# Altium project TactSwitch_Module_v2.PrjPcb
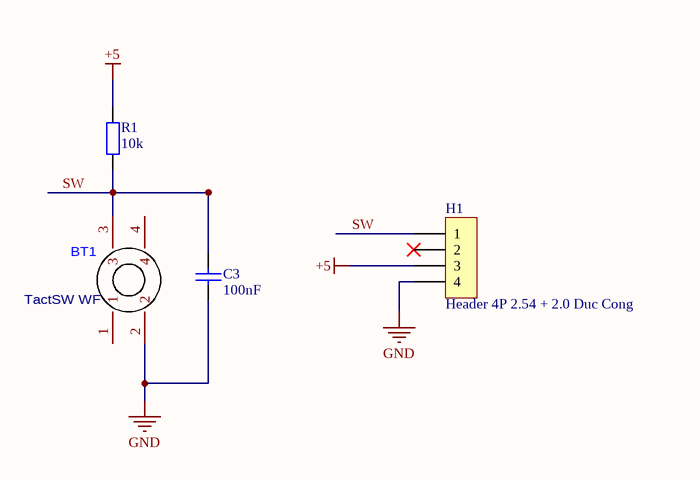
[diagram p0: TactSwitch_v2_SCH.SchDoc]
1 sheet, 4 parts. Net scope: global (net labels, ports and power ports of the same name join across sheets).
Board file: TactSwitch_v2_PCB.PcbDoc

## Sheet TactSwitch_v2_SCH.SchDoc
size A4; SheetNumber: 1; SheetTotal: 1

### Parts
BT1  TactSW WF  [12X12 BUTTOM red]
C3  100nF  [tu 0603]
H1  Header 4P 2.54 + 2.0 Duc Cong  [Header 4P DC 2.54 + 2.0]
R1  10k  [tro smd 0603]

### Nets
+5: H1.3 R1.2
GND: BT1.2 C3.2 H1.4
SW: BT1.3 C3.1 H1.1 R1.1

Not connected (* = marked no-connect by the designer): BT1 1 4; H1 2*

### Library data of the parts
BT1 = Nut Nhan 4 chan 12x12: WaterProof TactSW
C3 = Tu 0603 104 50V 10%: Dán; Don_Vi: Con; So_Chan: 2; Ten_Linh_Kien: Tụ 0603 104-100nF 10% 50V; Ma_Hang: MH004568; Chung_Loai: Dán; Kieu_Chan: *
H1 = Header 4P 2.54 + 2.0 Duc Cong: Cắm; Ten_Linh_Kien: Header 4P XH2.54-4P Đực Cong; Don_Vi: Con; Ma_Hang: MH001310; Chung_Loai: Cắm
R1 = Tro 0603 1% 10k: Dán; Don_Vi: Con; So_Chan: 2; Ten_Linh_Kien: Trở 0603 1% 10k; Ma_Hang: MH006333; Chung_Loai: Dán; Kieu_Chan: *